# EAGLE design R7FS5D37A3A01CFM (EAGLE 9.6.2)
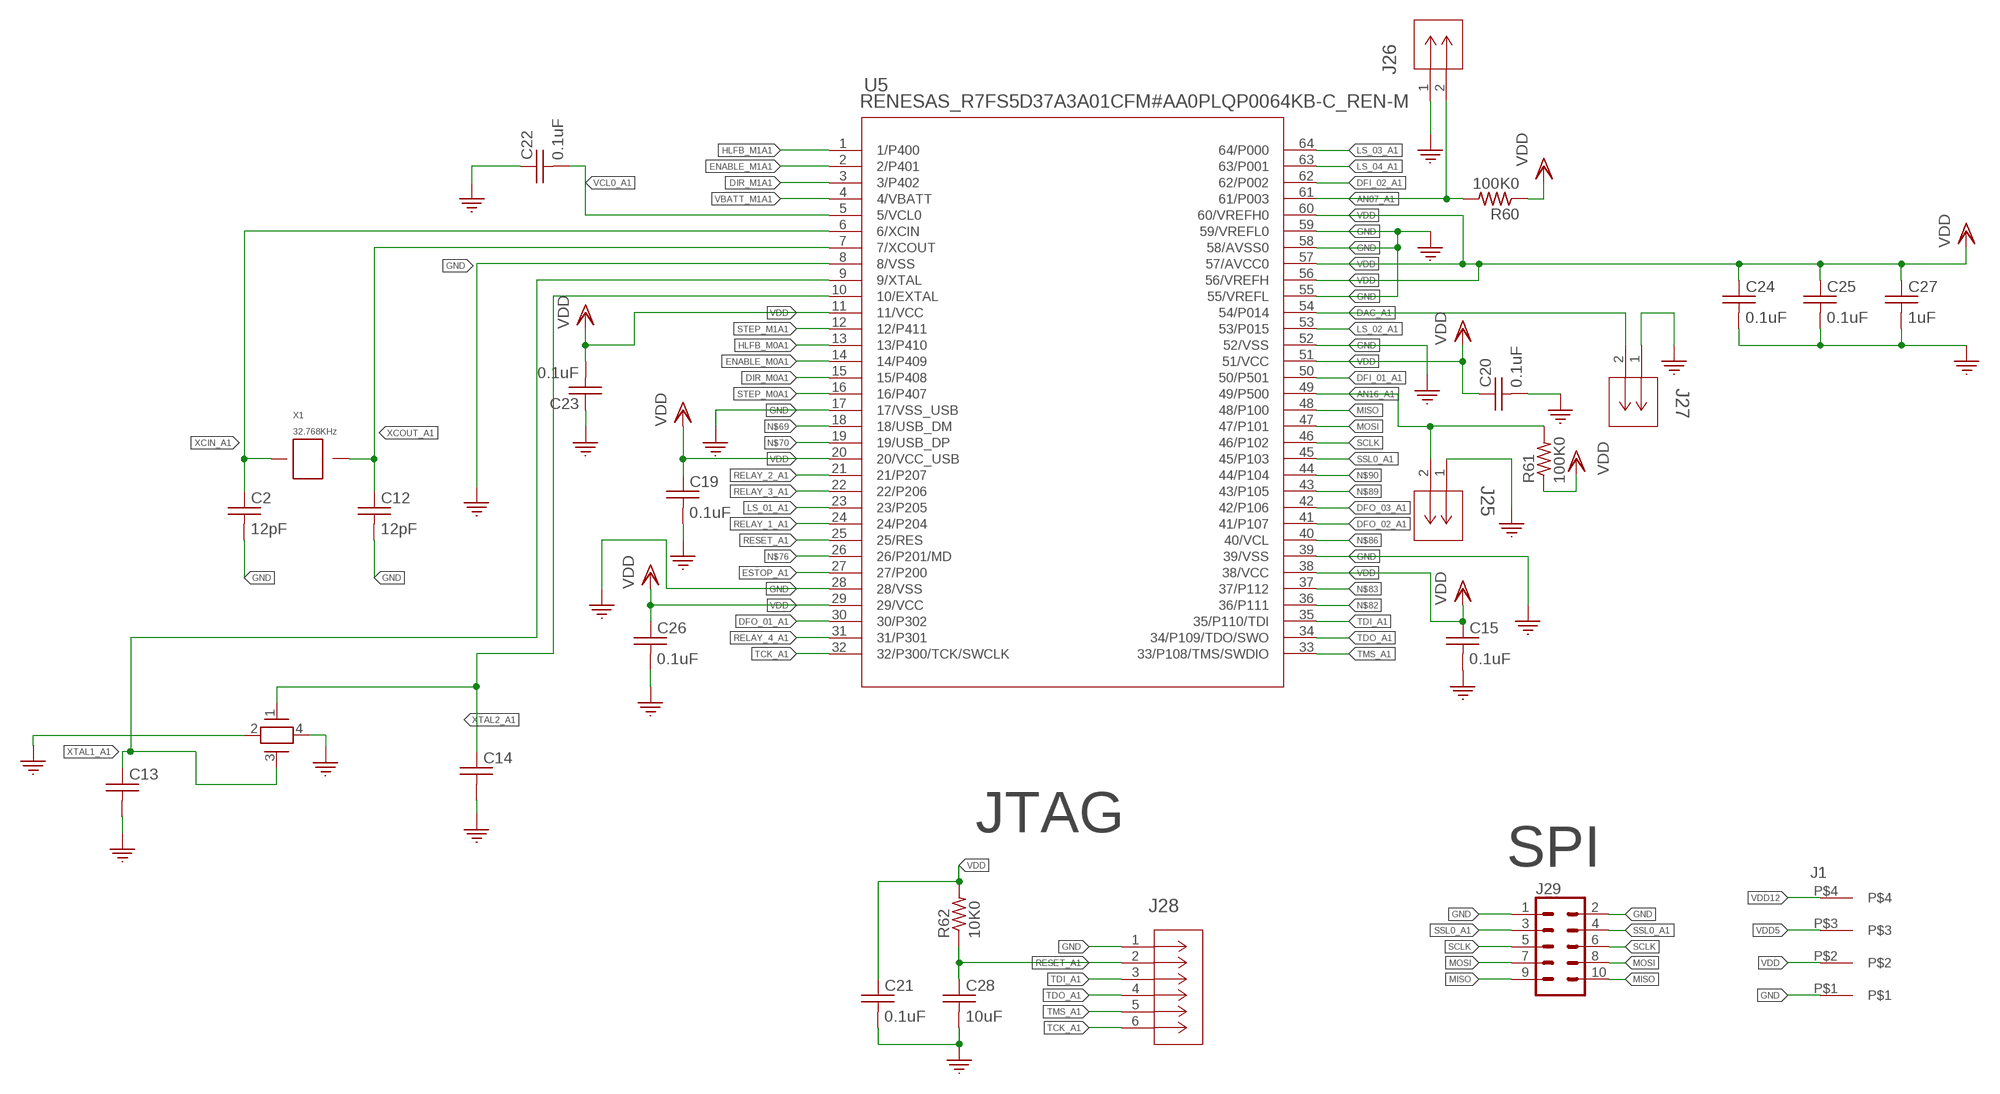
[diagram p0: schematic, sheet 1, part 1 of 3]
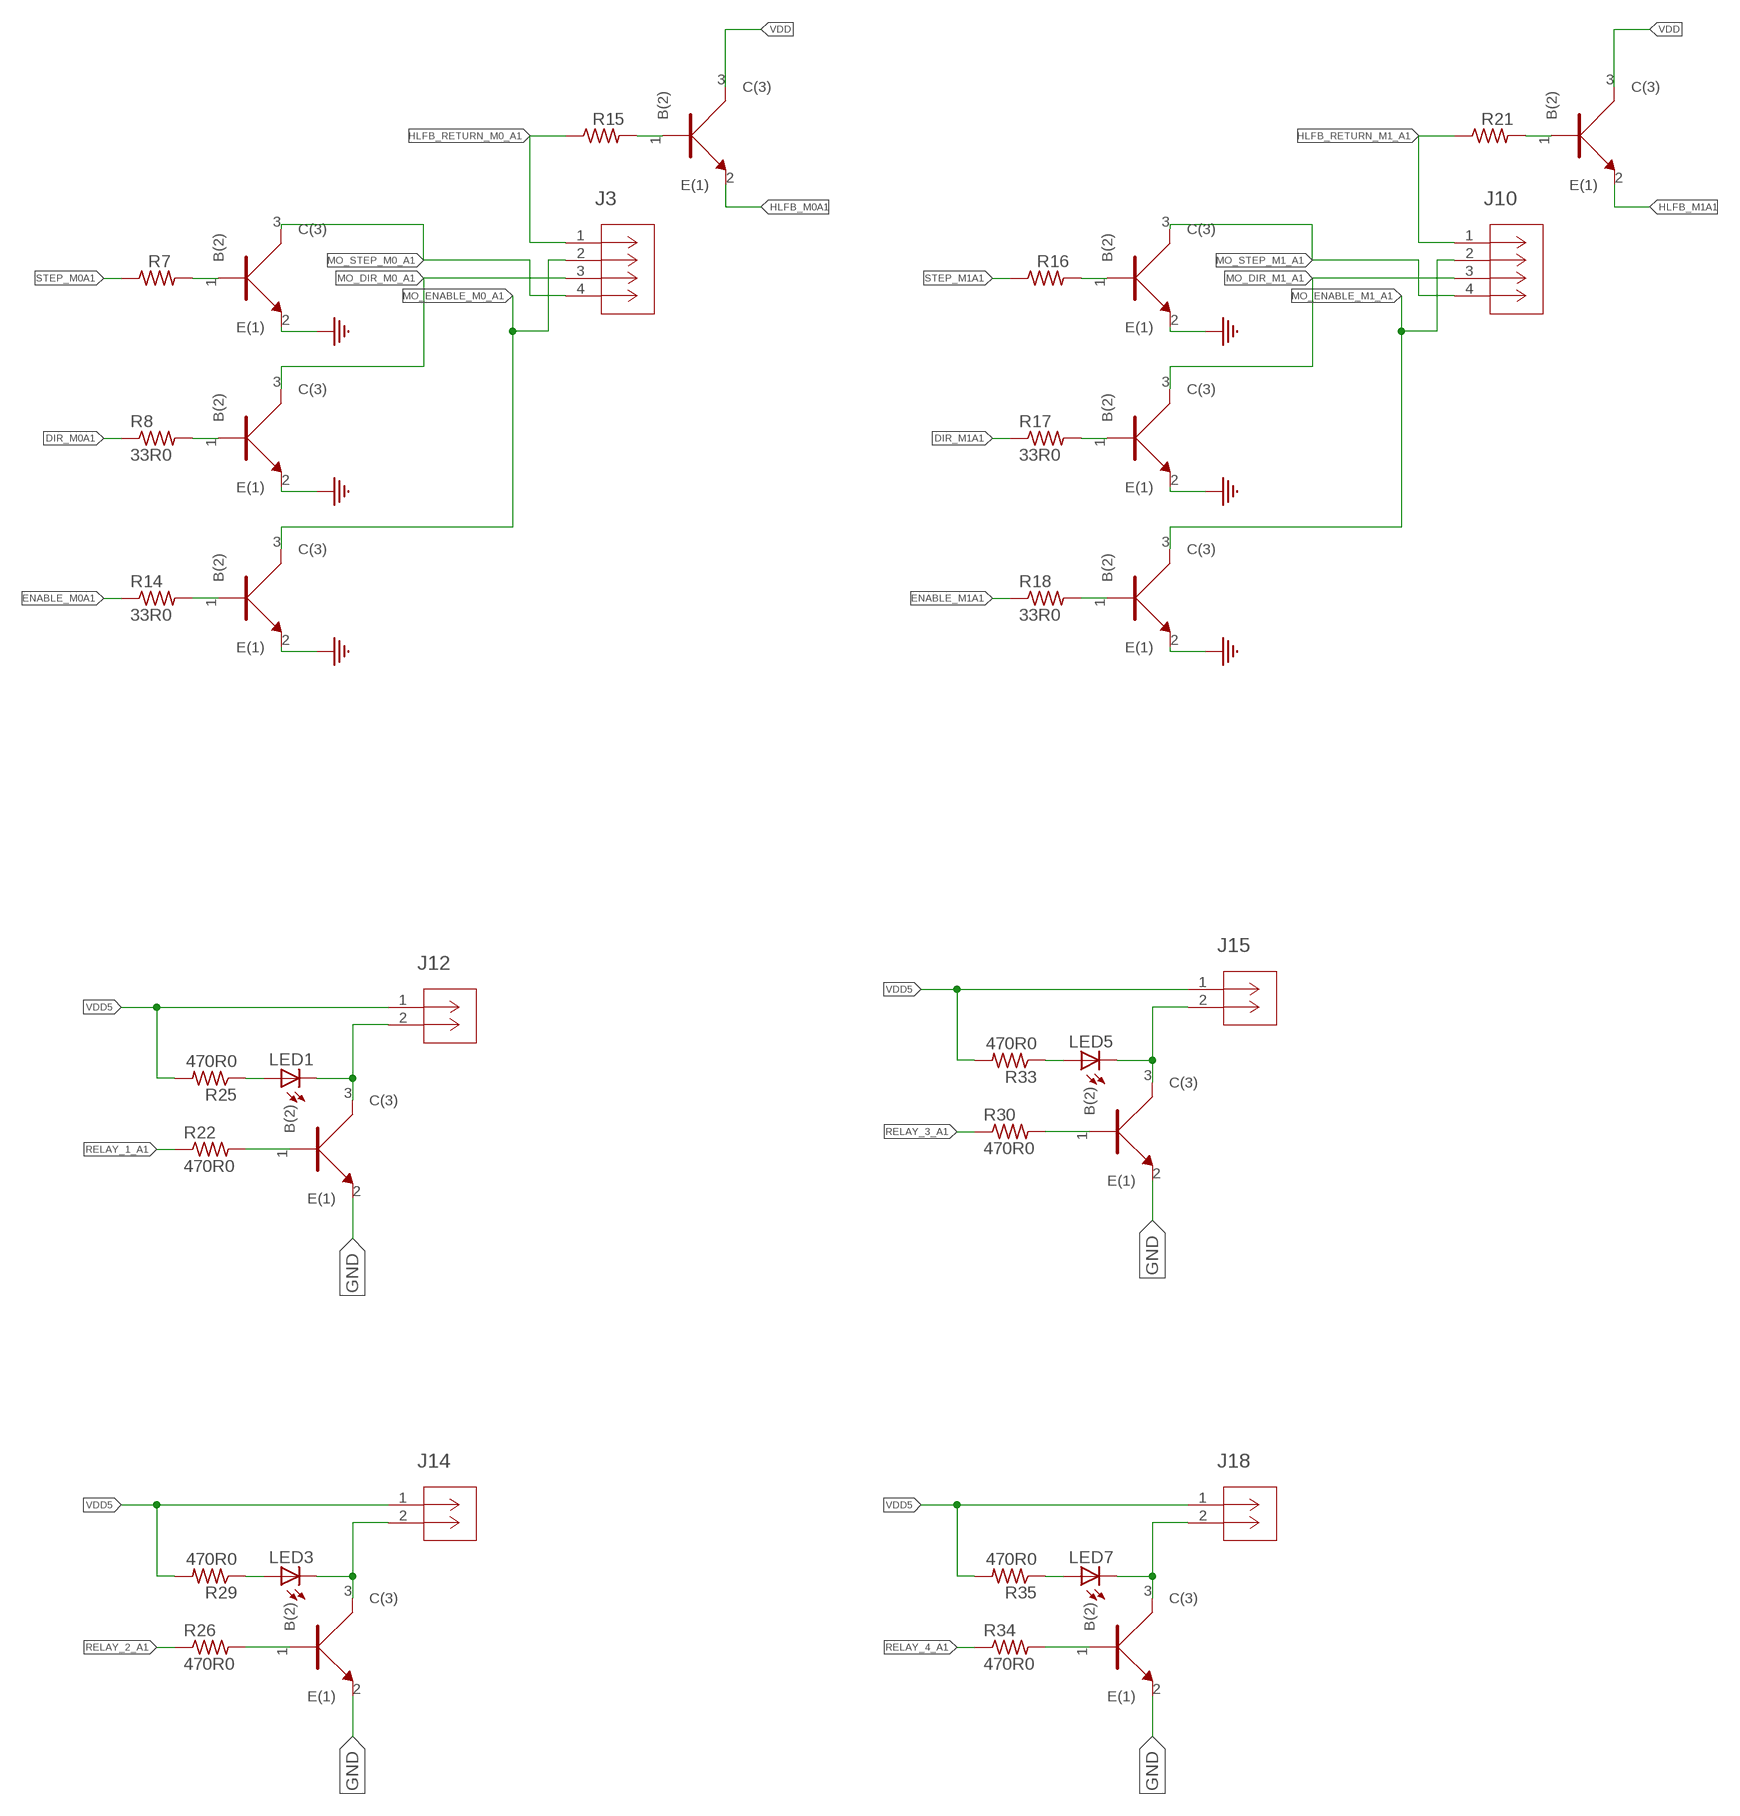
[diagram p1: schematic, sheet 1, part 2 of 3]
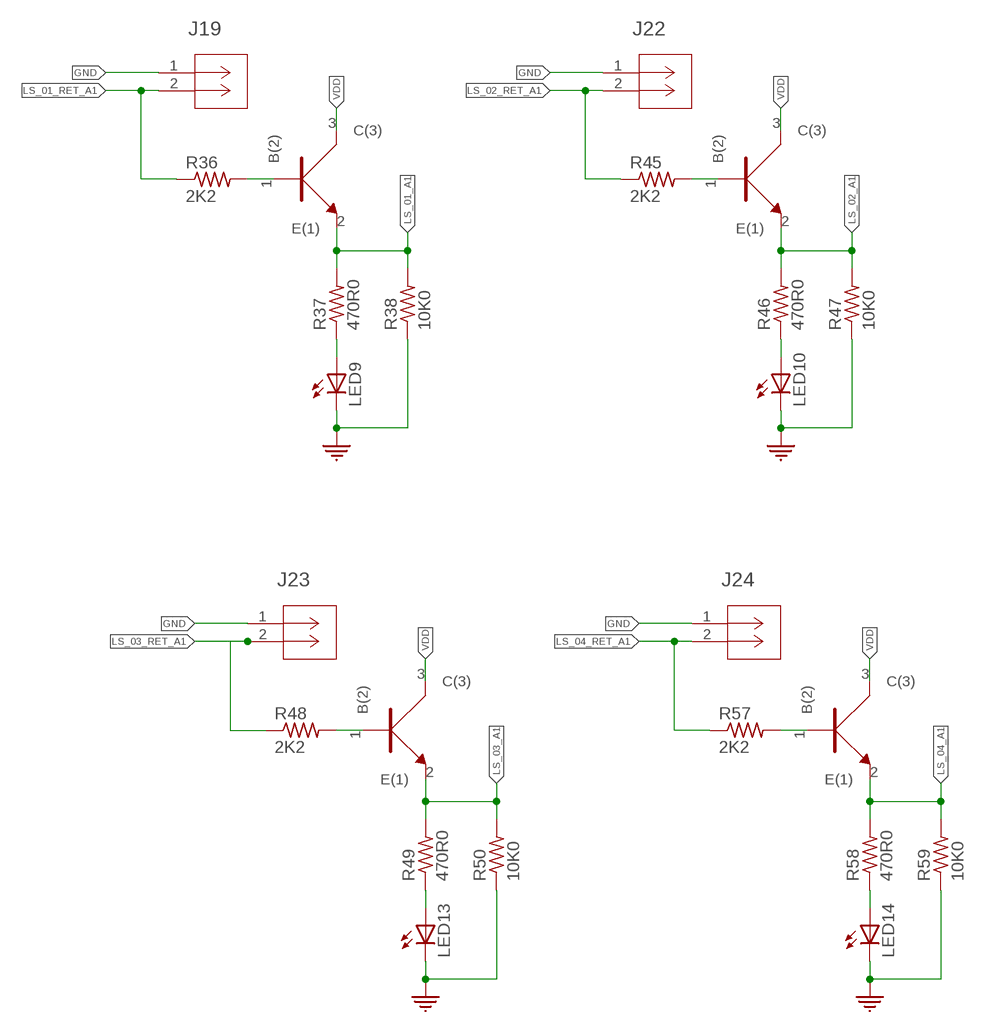
[diagram p2: schematic, sheet 1, part 3 of 3]

## Parts
C2  12pF  C_0402_12PF  [0402]
C12  12pF  C_0402_12PF  [0402]
C13  10pF  C_0402_10PF  [0402]
C14  10pF  C_0402_10PF  [0402]
C15  0.1uF  C_0402_0.1UF  [0402]
C19  0.1uF  C_0402_0.1UF  [0402]
C20  0.1uF  C_0402_0.1UF  [0402]
C21  0.1uF  C_0402_0.1UF  [0402]
C22  0.1uF  C_0402_0.1UF  [0402]
C23  0.1uF  C_0402_0.1UF  [0402]
C24  0.1uF  C_0402_0.1UF  [0402]
C25  0.1uF  C_0402_0.1UF  [0402]
C26  0.1uF  C_0402_0.1UF  [0402]
C27  1uF  C_0402_1UF  [0402]
C28  10uF  C_0402_10UF  [0402]
J1  4-pos  3.81MM_1_X_4_RT_ANGLE_PLUG_HEADER  [1X4_3.81MM_PITCH]
J3  CONN_530470410_PICOBLADE_X_4  [CON_530470410_MOL]
J10  CONN_530470410_PICOBLADE_X_4  [CON_530470410_MOL]
J12  CONN_530470210_PICOBLADE_X_2  [CON_530470210_MOL]
J14  CONN_530470210_PICOBLADE_X_2  [CON_530470210_MOL]
J15  CONN_530470210_PICOBLADE_X_2  [CON_530470210_MOL]
J18  CONN_530470210_PICOBLADE_X_2  [CON_530470210_MOL]
J19  CONN_530470210_PICOBLADE_X_2  [CON_530470210_MOL]
J22  CONN_530470210_PICOBLADE_X_2  [CON_530470210_MOL]
J23  CONN_530470210_PICOBLADE_X_2  [CON_530470210_MOL]
J24  CONN_530470210_PICOBLADE_X_2  [CON_530470210_MOL]
J25  CONN_530470210_PICOBLADE_X_2  [CON_530470210_MOL]
J26  CONN_530470210_PICOBLADE_X_2  [CON_530470210_MOL]
J27  CONN_530470210_PICOBLADE_X_2  [CON_530470210_MOL]
J28  CONN_530470610_PICOBLADE_X_6  [CON_530470610_MOL]
J29  CONN_05X2PTH  [2X5]
LED1  Green  LED_0805_GREEN  [0805]
LED3  Green  LED_0805_GREEN  [0805]
LED5  Green  LED_0805_GREEN  [0805]
LED7  Green  LED_0805_GREEN  [0805]
LED9  Green  LED_0805_GREEN  [0805]
LED10  Green  LED_0805_GREEN  [0805]
LED13  Green  LED_0805_GREEN  [0805]
LED14  Green  LED_0805_GREEN  [0805]
R7  33R0  R_0402_33R0  [0402]
R8  33R0  R_0402_33R0  [0402]
R14  33R0  R_0402_33R0  [0402]
R15  33R0  R_0402_33R0  [0402]
R16  33R0  R_0402_33R0  [0402]
R17  33R0  R_0402_33R0  [0402]
R18  33R0  R_0402_33R0  [0402]
R21  33R0  R_0402_33R0  [0402]
R22  470R0  R_0402_470R0  [0402]
R25  470R0  R_0402_470R0  [0402]
R26  470R0  R_0402_470R0  [0402]
R29  470R0  R_0402_470R0  [0402]
R30  470R0  R_0402_470R0  [0402]
R33  470R0  R_0402_470R0  [0402]
R34  470R0  R_0402_470R0  [0402]
R35  470R0  R_0402_470R0  [0402]
R36  2K2  R_0402_2K2  [0402]
R37  470R0  R_0402_470R0  [0402]
R38  10K0  R_0402_10K0  [0402]
R45  2K2  R_0402_2K2  [0402]
R46  470R0  R_0402_470R0  [0402]
R47  10K0  R_0402_10K0  [0402]
R48  2K2  R_0402_2K2  [0402]
R49  470R0  R_0402_470R0  [0402]
R50  10K0  R_0402_10K0  [0402]
R57  2K2  R_0402_2K2  [0402]
R58  470R0  R_0402_470R0  [0402]
R59  10K0  R_0402_10K0  [0402]
R60  100K0  R_0402_100K0  [0402]
R61  100K0  R_0402_100K0  [0402]
R62  10K0  R_0402_10K0  [0402]
U5  RENESAS_R7FS5D37A3A01CFM#AA0PLQP0064KB-C_REN-M  [PLQP0064KB-C_REN-M]
U6  NPN  BC846BW  [SOT323]
U7  NPN  BC846BW  [SOT323]
U8  NPN  BC846BW  [SOT323]
U13  NPN  BC846BW  [SOT323]
U14  NPN  BC846BW  [SOT323]
U15  NPN  BC846BW  [SOT323]
U16  NPN  BC846BW  [SOT323]
U18  NPN  BC846BW  [SOT323]
U20  NPN  BC846BW  [SOT323]
U22  NPN  BC846BW  [SOT323]
U24  NPN  BC846BW  [SOT323]
U26  NPN  BC846BW  [SOT323]
U27  NPN  BC846BW  [SOT323]
U30  NPN  BC846BW  [SOT323]
U31  NPN  BC846BW  [SOT323]
U34  NPN  BC846BW  [SOT323]
X1  32.768KHz  XTAL_32.768KHZ  [SMD_X_2_PADS]
Y2  XTAL_12MHZ_ABM8G-12.000MHZ-B4Y-T  [CRYSTAL_ABM8G_ABR]

## Nets
AN07_A1: J26.2 R60.P$2 U5.61(61/P003)
AN16_A1: J25.2 R61.P$2 U5.49(49/P500)
DAC_A1: J27.2 U5.54(54/P014)
DFI_01_A1: U5.50(50/P501)
DFI_02_A1: U5.62(62/P002)
DFO_01_A1: U5.30(30/P302)
DFO_02_A1: U5.41(41/P107)
DFO_03_A1: U5.42(42/P106)
DIR_M0A1: R8.P$1 U5.15(15/P408)
DIR_M1A1: R17.P$1 U5.3(3/P402)
ENABLE_M0A1: R14.P$1 U5.14(14/P409)
ENABLE_M1A1: R18.P$1 U5.2(2/P401)
ESTOP_A1: U5.27(27/P200)
GND: C2.P$2 C12.P$2 C13.P$2 C14.P$2 C15.P$2 C19.P$2 C20.P$2 C21.P$2 C22.P$1 C23.P$1 C24.P$2 C25.P$2 C26.P$2 C27.P$2 C28.P$2 J1.P$1 J19.1 J22.1 J23.1 J24.1 J25.1 J26.1 J27.1 J28.1 J29.1 J29.2 LED9.2(C) LED10.2(C) LED13.2(C) LED14.2(C) R38.P$1 R47.P$1 R50.P$1 R59.P$1 U5.8(8/VSS) U5.17(17/VSS_USB) U5.28(28/VSS) U5.39(39/VSS) U5.52(52/VSS) U5.55(55/VREFL) U5.58(58/AVSS0) U5.59(59/VREFL0) U6.2(E(1)) U7.2(E(1)) U8.2(E(1)) U14.2(E(1)) U15.2(E(1)) U16.2(E(1)) U20.2(E(1)) U22.2(E(1)) U24.2(E(1)) U26.2(E(1)) Y2.2 Y2.4
HLFB_M0A1: U5.13(13/P410) U13.2(E(1))
HLFB_M1A1: U5.1(1/P400) U18.2(E(1))
HLFB_RETURN_M0_A1: J3.1 R15.P$1
HLFB_RETURN_M1_A1: J10.1 R21.P$1
LS_01_A1: R37.P$2 R38.P$2 U5.23(23/P205) U27.2(E(1))
LS_01_RET_A1: J19.2 R36.P$1
LS_02_A1: R46.P$2 R47.P$2 U5.53(53/P015) U30.2(E(1))
LS_02_RET_A1: J22.2 R45.P$1
LS_03_A1: R49.P$2 R50.P$2 U5.64(64/P000) U31.2(E(1))
LS_03_RET_A1: J23.2 R48.P$1
LS_04_A1: R58.P$2 R59.P$2 U5.63(63/P001) U34.2(E(1))
LS_04_RET_A1: J24.2 R57.P$1
MISO: J29.9 J29.10 U5.48(48/P100)
MO_DIR_M0_A1: J3.3 U7.3(C(3))
MO_DIR_M1_A1: J10.3 U15.3(C(3))
MO_ENABLE_M0_A1: J3.2 U8.3(C(3))
MO_ENABLE_M1_A1: J10.2 U16.3(C(3))
MO_STEP_M0_A1: J3.4 U6.3(C(3))
MO_STEP_M1_A1: J10.4 U14.3(C(3))
MOSI: J29.7 J29.8 U5.47(47/P101)
N$6: R8.P$2 U7.1(B(2))
N$7: R14.P$2 U8.1(B(2))
N$14: R7.P$2 U6.1(B(2))
N$15: R15.P$2 U13.1(B(2))
N$16: R17.P$2 U15.1(B(2))
N$17: R18.P$2 U16.1(B(2))
N$18: R16.P$2 U14.1(B(2))
N$19: R21.P$2 U18.1(B(2))
N$23: R22.P$2 U20.1(B(2))
N$24: J12.2 LED1.2(C) U20.3(C(3))
N$25: LED1.1(A) R25.P$1
N$29: R26.P$2 U22.1(B(2))
N$30: J14.2 LED3.2(C) U22.3(C(3))
N$31: LED3.1(A) R29.P$1
N$35: R30.P$2 U24.1(B(2))
N$36: J15.2 LED5.2(C) U24.3(C(3))
N$37: LED5.1(A) R33.P$1
N$41: R34.P$2 U26.1(B(2))
N$42: J18.2 LED7.2(C) U26.3(C(3))
N$43: LED7.1(A) R35.P$1
N$44: R36.P$2 U27.1(B(2))
N$49: LED9.1(A) R37.P$1
N$50: R45.P$2 U30.1(B(2))
N$51: LED10.1(A) R46.P$1
N$52: R48.P$2 U31.1(B(2))
N$57: LED13.1(A) R49.P$1
N$58: R57.P$2 U34.1(B(2))
N$59: LED14.1(A) R58.P$1
N$69: U5.18(18/USB_DM)
N$70: U5.19(19/USB_DP)
N$76: U5.26(26/P201/MD)
N$82: U5.36(36/P111)
N$83: U5.37(37/P112)
N$86: U5.40(40/VCL)
N$89: U5.43(43/P105)
N$90: U5.44(44/P104)
RELAY_1_A1: R22.P$1 U5.24(24/P204)
RELAY_2_A1: R26.P$1 U5.21(21/P207)
RELAY_3_A1: R30.P$1 U5.22(22/P206)
RELAY_4_A1: R34.P$1 U5.31(31/P301)
RESET_A1: C28.P$1 J28.2 R62.P$1 U5.25(25/RES)
SCLK: J29.5 J29.6 U5.46(46/P102)
SSL0_A1: J29.3 J29.4 U5.45(45/P103)
STEP_M0A1: R7.P$1 U5.16(16/P407)
STEP_M1A1: R16.P$1 U5.12(12/P411)
TCK_A1: J28.6 U5.32(32/P300/TCK/SWCLK)
TDI_A1: J28.3 U5.35(35/P110/TDI)
TDO_A1: J28.4 U5.34(34/P109/TDO/SWO)
TMS_A1: J28.5 U5.33(33/P108/TMS/SWDIO)
VBATT_M1A1: U5.4(4/VBATT)
VCL0_A1: C22.P$2 U5.5(5/VCL0)
VDD: C15.P$1 C19.P$1 C20.P$1 C21.P$1 C23.P$2 C24.P$1 C25.P$1 C26.P$1 C27.P$1 J1.P$2 R60.P$1 R61.P$1 R62.P$2 U5.11(11/VCC) U5.20(20/VCC_USB) U5.29(29/VCC) U5.38(38/VCC) U5.51(51/VCC) U5.56(56/VREFH) U5.57(57/AVCC0) U5.60(60/VREFH0) U13.3(C(3)) U18.3(C(3)) U27.3(C(3)) U30.3(C(3)) U31.3(C(3)) U34.3(C(3))
VDD5: J1.P$3 J12.1 J14.1 J15.1 J18.1 R25.P$2 R29.P$2 R33.P$2 R35.P$2
VDD12: J1.P$4
XCIN_A1: C2.P$1 U5.6(6/XCIN) X1.P$1
XCOUT_A1: C12.P$1 U5.7(7/XCOUT) X1.P$2
XTAL1_A1: C13.P$1 U5.9(9/XTAL) Y2.3
XTAL2_A1: C14.P$1 U5.10(10/EXTAL) Y2.1

## Notes on the sheet
- JTAG
- SPI

## Library data of the parts
C2 C12 = 3D_MIG_Controller:C_0402_12PF; PARTNO: CL05C120JB5NNNC
C13 C14 = 3D_MIG_Controller:C_0402_10PF; PARTNO: CC0402JRNPO9BN100
C15 C19-C26 = 3D_MIG_Controller:C_0402_0.1UF; PARTNO: CL05F104ZO5NNNC
C27 = 3D_MIG_Controller:C_0402_1UF; PARTNO: CL05A105KO5NNNC
C28 = 3D_MIG_Controller:C_0402_10UF; PARTNO: CL05A106MP8NUB8
J1 = 3D_MIG_Controller:3.81MM_1_X_4_RT_ANGLE_PLUG_HEADER: 4 Position Terminal Block Header, Male Pins, Shrouded (4 Side) 0.150" (3.81mm) 90°, Right Angle - Through Hole; PARTNO: 691322310004
J3 J10 = 3D_MIG_Controller:CONN_530470410_PICOBLADE_X_4; COPYRIGHT: Copyright (C) 2022 Ultra Librarian. All rights reserved.; MFR_NAME: Molex Connector Corporation; PARTNO: 530470410
J12 J14 J15 J18 J19 J22-J27 = 3D_MIG_Controller:CONN_530470210_PICOBLADE_X_2; MFR_NAME: Molex Connector Corporation; PARTNO: 530470210
J28 = 3D_MIG_Controller:CONN_530470610_PICOBLADE_X_6; COPYRIGHT: Copyright (C) 2023 Ultra Librarian. All rights reserved.; MFR_NAME: Molex Connector Corporation; PARTNO: 530470610
J29 = 3D_MIG_Controller:CONN_05X2: Multi connection point. Often used as Generic Header-pin footprint for 0.1 inch spaced/style header connections For AVR SPI programming port, see special device with nice symbol: "AVR_SPI_PROG_5x2.dev" You can populate with any combo of single row headers, but if you'd like an exact match, check these: 2x5 AVR ICSP Male Header <https://www.sparkfun.com/products/778> (PRT-00778) 2x5 Pin Shrouded Header <https://www.sparkfun.com/products/8506> (PRT-08506) On any of the 0.1 inch spaced packages, you can populate with these: Break Away Headers - Straight <https://www.sparkfun.com/products/116> (PRT-00116) Break Away Male Headers - Right Angle <https://www.sparkfun.com/products/553> (PRT-00553) Female Headers <https://www.sparkfun.com/products/115> (PRT-00115) Break Away Headers - Machine Pin <https://www.sparkfun.com/products/117> (PRT-00117) Break Away Female Headers - Swiss Machine Pin <https://www.sparkfun.com/products/743> (PRT-00743) Special note: the shrouded connector mates well with our 5x2 ribbon cables: 2x5 Pin IDC Ribbon Cable <https://www.sparkfun.com/products/8535> (PRT-08535); PROD_ID: CONN-08499; SF_ID: PRT-0778
LED1 LED3 LED5 LED7 LED9 LED10 LED13 LED14 = 3D_MIG_Controller:LED_0805_GREEN: Green 570nm LED Indication - Discrete 2.2V 0805 (2012 Metric); PARTNO: LG R971-KN-1
R7 R8 R14-R18 R21 = 3D_MIG_Controller:R_0402_33R0; PARTNO: RMCF0402JT33R0
R22 R25 R26 R29 R30 R33-R35 R37 R46 R49 R58 = 3D_MIG_Controller:R_0402_470R0; PARTNO: RMCF0402JT470R
R36 R45 R48 R57 = 3D_MIG_Controller:R_0402_2K2; PARTNO: RMCF0402JT2K20
R38 R47 R50 R59 R62 = 3D_MIG_Controller:R_0402_10K0; PARTNO: RMCF0402JT10K0
R60 R61 = 3D_MIG_Controller:R_0402_100K0; PARTNO: RCG0402100KFKED
U5 = 3D_MIG_Controller:RENESAS_R7FS5D37A3A01CFM#AA0; COPYRIGHT: Copyright (C) 2023 Ultra Librarian. All rights reserved.; MFR_NAME: Renesas Electronics; PARTNO: R7FS3A37A3A01CFM#AA0
U6-U8 U13-U16 U18 U20 U22 U24 U26 U27 U30 U31 U34 = 3D_MIG_Controller:BC846BW: Bipolar (BJT) Transistor NPN 100MHz Surface Mount SOT-323; PARTNO: BC846BW_NPN
X1 = 3D_MIG_Controller:XTAL_32.768KHZ; PARTNO: ABS07-32.768KHZ-T
Y2 = 3D_MIG_Controller:XTAL_12MHZ_ABM8G-12.000MHZ-B4Y-T; COPYRIGHT: Copyright (C) 2023 Ultra Librarian. All rights reserved.; MFR_NAME: Abracon; PARTNO: ABM8G-12.000MHZ-B4Y-T

## Board
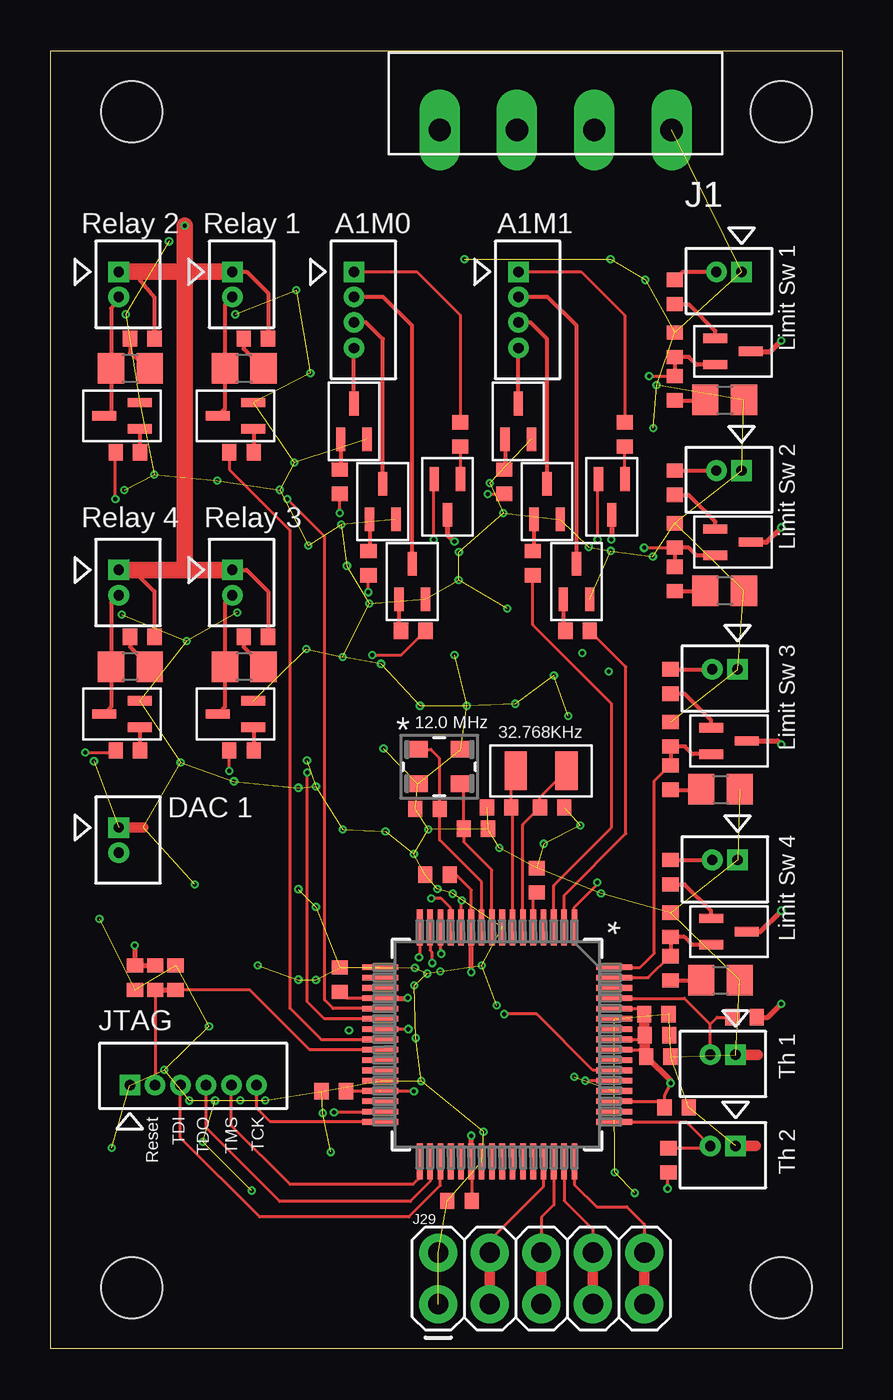
[diagram p3: board, top side]
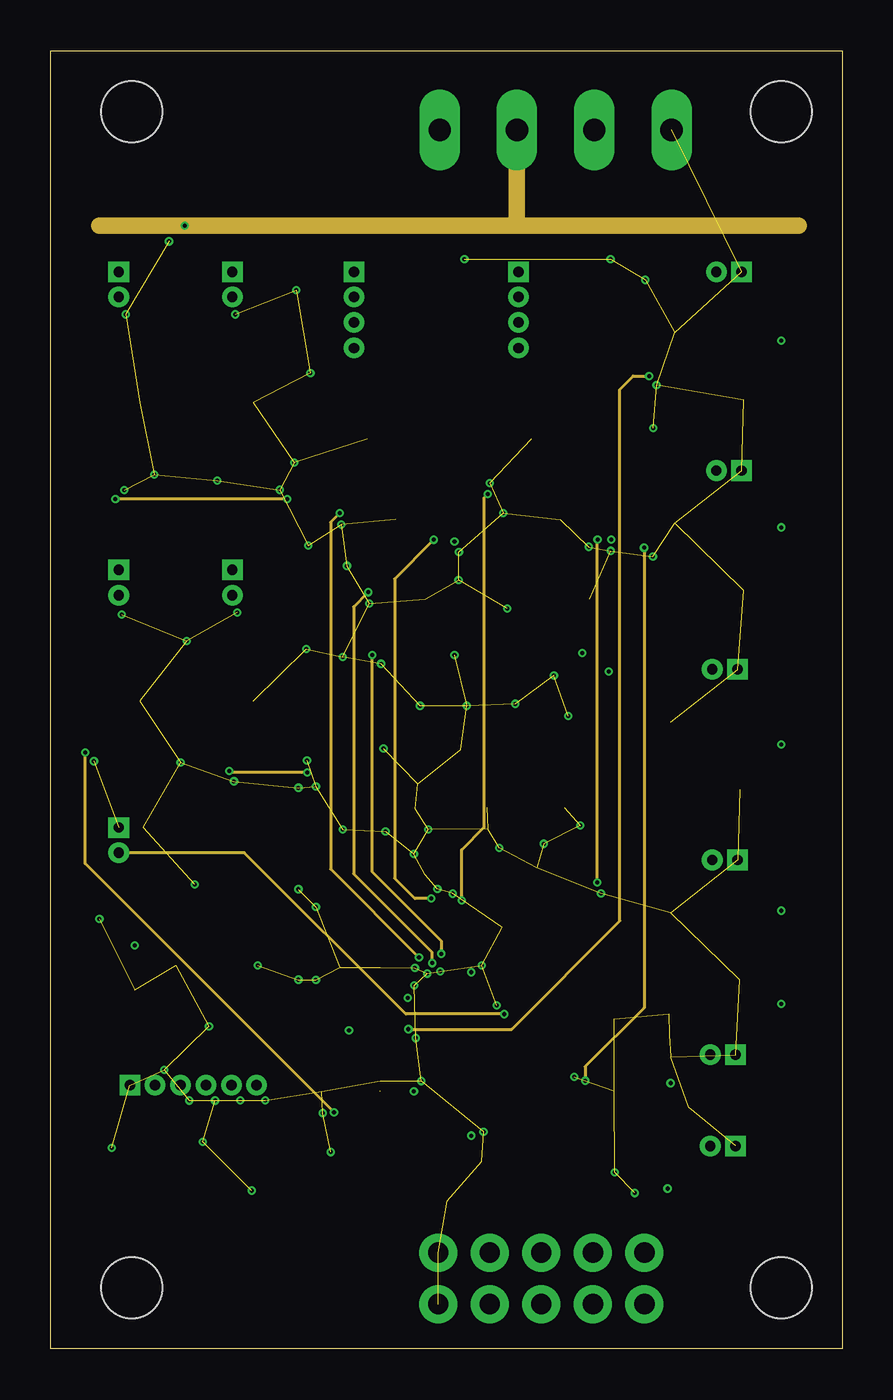
[diagram p4: board, inner layer Route3]
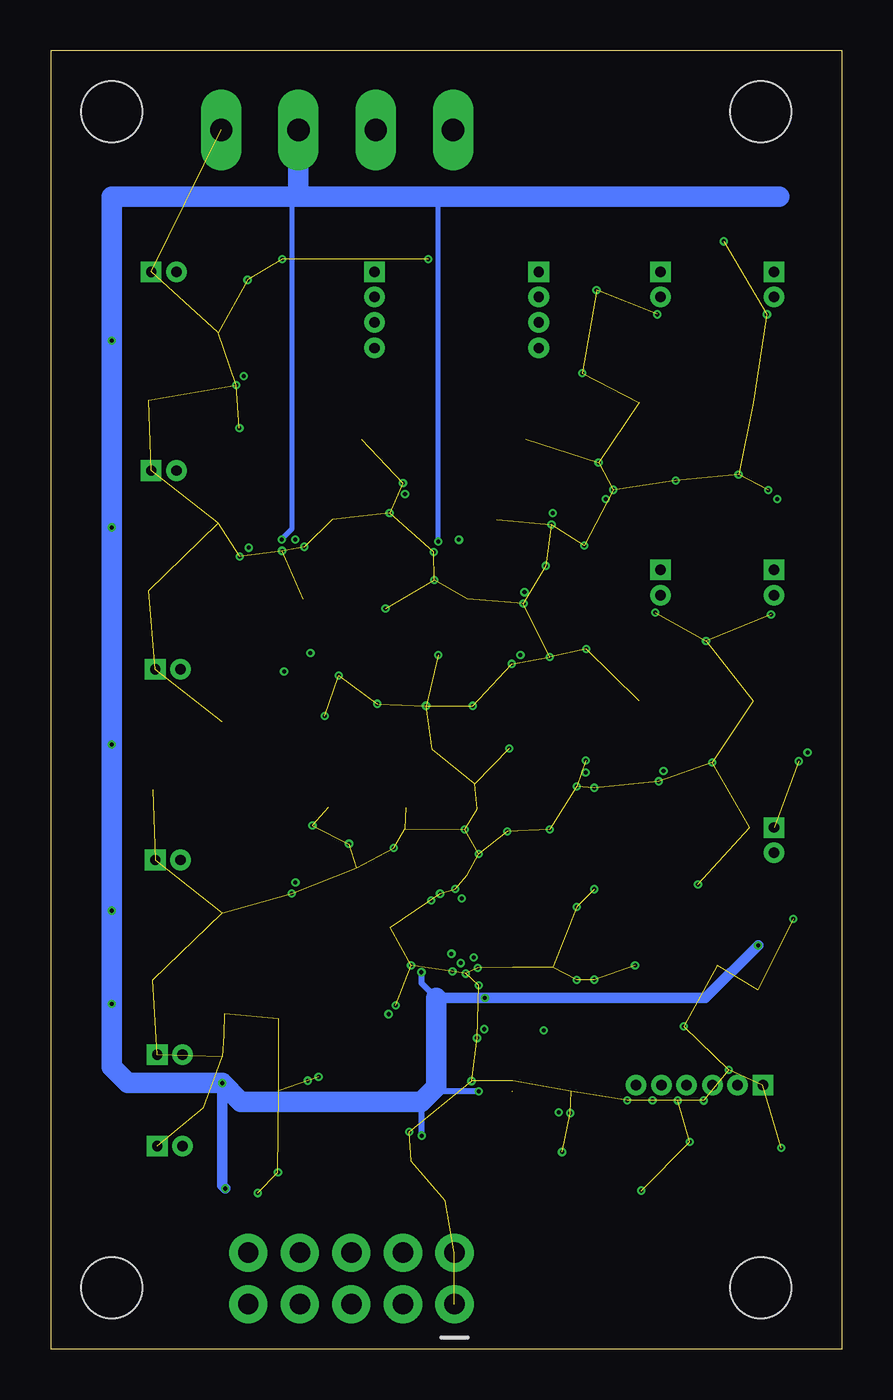
[diagram p5: board, bottom side, seen from below]

Size 39 x 64 mm. Coordinates in mm from the lower left corner, seen from the top.
Outline: 0,64 39,64 39,0 0,0 0,64
Copper layers ([3:[2:[15:1+2*3+14*15+16:2]:15]]): Top 0.0348mm / dielectric 0.1mm / Route2 0.0348mm / dielectric 0.546mm / Route3 0.0348mm / dielectric 0.1mm / Route14 0.0348mm / dielectric 0.546mm / Route15 0.0348mm / dielectric 0.1mm / Bottom 0.0348mm
Design rules "default *": minimum track width 0.15mm, minimum drill 0.2mm, track to track 6mil, track to pad 6mil, pad to pad 6mil, via to via 6mil, smd to smd 6mil, copper to edge 40mil, drill to drill 6mil, minimum pad ring 10mil, minimum via ring 4mil, stop-mask expansion 4mil, vias tented up to drill 0mil, thermal gap 10mil
Holes 3 mm at 36,3 36,61 4,61 4,3

### Footprints (pad centres in the part's own frame; a part is rotated, then mirrored left to right if it is on the bottom)
0402 = smd 0.8 x 0.7: P$1 0,0.6; P$2 0,-0.6
1X4_3.81MM_PITCH = drill 1.1 pad 2 long: P$1 0,0; P$2 3.81,0; P$3 7.62,0; P$4 11.43,0
CON_530470410_MOL = drill 0.508 pad 0.838 square: 1 0,0 | drill 0.508 pad 0.838: 2 -1.245,0; 3 -2.489,0; 4 -3.759,0
CON_530470210_MOL = drill 0.508 pad 0.838 square: 1 0,0 | drill 0.508 pad 0.838: 2 -1.245,0
CON_530470610_MOL = drill 0.508 pad 0.838 square: 1 0,0 | drill 0.508 pad 0.838: 2 -1.245,0; 3 -2.489,0; 4 -3.759,0; 5 -5.004,0; 6 -6.248,0
2X5 = drill 1 pad 1.88: 1 0,0; 2 0,2.54; 3 2.54,0; 4 2.54,2.54; 5 5.08,0; 6 5.08,2.54; 7 7.62,0; 8 7.62,2.54; 9 10.16,0; 10 10.16,2.54
0805 = smd 1.3 x 1.5: 1 -0.95,0; 2 0.95,0
PLQP0064KB-C_REN-M = smd 1.778 x 0.279: 1 -5.766,3.81; 2 -5.766,3.302; 3 -5.766,2.794; 4 -5.766,2.286; 5 -5.766,1.778; 6 -5.766,1.27; 7 -5.766,0.762; 8 -5.766,0.254; 9 -5.766,-0.254; 10 -5.766,-0.762; 11 -5.766,-1.27; 12 -5.766,-1.778; 13 -5.766,-2.286; 14 -5.766,-2.794; 15 -5.766,-3.302; 16 -5.766,-3.81; 33 5.766,-3.81; 34 5.766,-3.302; 35 5.766,-2.794; 36 5.766,-2.286; 37 5.766,-1.778; 38 5.766,-1.27; 39 5.766,-0.762; 40 5.766,-0.254; 41 5.766,0.254; 42 5.766,0.762; 43 5.766,1.27; 44 5.766,1.778; 45 5.766,2.286; 46 5.766,2.794; 47 5.766,3.302; 48 5.766,3.81 | smd 0.279 x 1.778: 17 -3.81,-5.766; 18 -3.302,-5.766; 19 -2.794,-5.766; 20 -2.286,-5.766; 21 -1.778,-5.766; 22 -1.27,-5.766; 23 -0.762,-5.766; 24 -0.254,-5.766; 25 0.254,-5.766; 26 0.762,-5.766; 27 1.27,-5.766; 28 1.778,-5.766; 29 2.286,-5.766; 30 2.794,-5.766; 31 3.302,-5.766; 32 3.81,-5.766; 49 3.81,5.766; 50 3.302,5.766; 51 2.794,5.766; 52 2.286,5.766; 53 1.778,5.766; 54 1.27,5.766; 55 0.762,5.766; 56 0.254,5.766; 57 -0.254,5.766; 58 -0.762,5.766; 59 -1.27,5.766; 60 -1.778,5.766; 61 -2.286,5.766; 62 -2.794,5.766; 63 -3.302,5.766; 64 -3.81,5.766
SOT323 = smd 0.457 x 1.168: 1 -0.65,-0.876; 2 0.65,-0.876; 3 0,0.876
SMD_X_2_PADS = smd 1.9 x 1.1: P$1 0,1.25; P$2 0,-1.25
CRYSTAL_ABM8G_ABR = smd 0.991 x 0.813: 1 -1.054,0.85; 2 -1.054,-0.85; 3 1.054,-0.85; 4 1.054,0.85

### Placement (x,y rotation side)
C2  24.71,26.69 90 top
C12  22.1,26.69 270 top
C13  20.95,25.64 90 top
C14  18.57,26.61 270 top
C15  20.15,7.3 270 top
C19  14.25,18.2 180 top
C20  30.85,11.9 90 top
C21  4.15,18.3 0 top
C22  23.95,23.1 0 top
C23  19.06,23.37 90 top
C24  29.95,14.4 90 top
C25  29.88,15.47 90 top
C26  13.95,12.7 270 top
C27  29.85,16.5 90 top
C28  6.15,18.3 180 top
J1  30.6,60.1 180 top
J3  14.95,53.1 90 top
J10  23.05,53.1 90 top
J12  8.95,53.1 90 top
J14  3.35,53.1 90 top
J15  8.95,38.4 90 top
J18  3.35,38.4 90 top
J19  34.05,53.1 0 top
J22  34.05,43.3 0 top
J23  33.85,33.5 0 top
J24  33.85,24.1 0 top
J25  33.75,10 0 top
J26  33.75,14.5 0 top
J27  3.35,25.7 90 top
J28  3.9,13 180 top
J29  19.1,2.2 0 top
LED1  9.53,48.33 180 top
LED3  3.93,48.33 180 top
LED5  9.53,33.63 180 top
LED7  3.93,33.63 180 top
LED9  33.21,46.78 0 top
LED10  33.21,37.38 0 top
LED13  33.01,27.58 0 top
LED14  33.01,18.18 0 top
R7  14.25,42.75 180 top
R8  15.66,38.73 180 top
R14  17.87,35.4 270 top
R15  20.19,45.08 0 top
R16  22.35,42.75 180 top
R17  23.76,38.73 180 top
R18  25.97,35.4 270 top
R21  28.29,45.08 0 top
R22  9.4,44.2 90 top
R25  10.11,49.8 90 top
R26  3.8,44.2 90 top
R29  4.51,49.8 90 top
R30  9.4,29.5 90 top
R33  10.11,35.11 90 top
R34  3.8,29.5 90 top
R35  4.51,35.11 90 top
R36  30.75,52.1 0 top
R37  30.75,47.36 180 top
R38  30.75,49.5 0 top
R45  30.75,42.7 0 top
R46  30.75,37.96 180 top
R47  30.75,40.1 0 top
R48  30.55,32.9 0 top
R49  30.55,28.16 180 top
R50  30.55,30.3 0 top
R57  30.55,23.5 0 top
R58  30.55,18.76 180 top
R59  30.55,20.9 0 top
R60  34.2,16.35 270 top
R61  30.45,9.3 180 top
R62  5.15,18.3 180 top
U5  22,15 270 top
U6  14.94,45.72 0 top
U7  16.36,41.77 0 top
U8  17.81,37.83 0 top
U13  19.55,42 180 top
U14  23.04,45.72 0 top
U15  24.46,41.77 0 top
U16  25.91,37.83 0 top
U18  27.65,42 180 top
U20  9.11,46 90 top
U22  3.51,46 90 top
U24  9.11,31.3 90 top
U26  3.51,31.3 90 top
U27  33.63,49.17 270 top
U30  33.63,39.77 270 top
U31  33.43,29.97 270 top
U34  33.43,20.57 270 top
X1  24.17,28.49 270 top
Y2  19.15,28.7 0 top

### Tracks (layer width: path | path; a pad name or v marks a point on that pad's centre or on a via)
AN07_A1
  Top 0.15: J26.2 32.51,16 | R60.P$2 32.85,16.35 32.51,16 | 32.51,16 31.23,17.29 U5.61
AN16_A1
  Top 0.15: U5.49 31.31,11.19 J25.2 32.41,9.9 R61.P$2
DAC_A1  (via drill 0.2)
  Top 0.15: U5.54 26.72,13.73 23.95,16.5 v22.35,16.5
  Route3 0.15: J27.2 9.54,24.45 17.5,16.5 v22.35,16.5
DIR_M0A1  (via drill 0.2)
  Top 0.15: v18.8,19.02 18.8,19.55 18.7,19.64 U5.15
  Top 0.152: v15.65,37.3 R8.P$1
  Route3 0.15: v15.65,37.3 14.93,36.58 14.93,23.41 18.8,19.55 v18.8,19.02
DIR_M1A1
  Top 0.15: U5.3 24.79,22.84 27.65,25.7 27.65,31.8 23.76,35.69 R17.P$1
ENABLE_M0A1  (via drill 0.2)
  Top 0.15: v15.85,34.2 17.27,34.2 R14.P$1 | U5.14 19.21,19.52 v19.25,19.48
  Route3 0.15: v19.25,19.48 19.25,20.1 15.85,23.5 v15.85,34.2
ENABLE_M1A1
  Top 0.15: U5.2 25.3,22.35 28.35,25.4 28.35,33.62 R18.P$1
GND  (via drill 0.2)  (139 unrouted)
  Top 0.508: J26.1 34.85,14.5 | J25.1 34.75,10 | J27.1 4.55,25.7
  other vias: 5.83,54.6 3.63,42.33 11.28,42.35 14.32,40.64 20.39,53.73 27.59,53.73 16.28,33.77 15.7,36.74 29.68,39.06 27.6,39.34 26.51,39.54 29.86,47.51 19.81,22.44 19.06,22.67 27.12,22.45 25.8,13.41 17.99,15.32 19.2,18.6 18.55,18.5 17.95,18.78 21.99,16.93 13.4,11.62 28.79,7.68 2.13,28.97 9.03,27.98 12.63,29.01 21.24,18.91 17.91,17.92 21.33,10.69 18.26,13.2 3.5,36.2 9.2,36.3 3.7,51 9.1,51 7.1,22.9 10.2,18.9 12.21,18.2 13.07,18.19 13.07,21.79 12.21,22.66 12.21,27.66 13.07,27.73 14.4,25.6 16.5,25.5 17.9,24.4 18.6,25.6 22.1,24.7 24.3,24.9 26.1,25.8 6.4,28.9 6.7,34.9 12.6,34.5 14.4,34.1 16.4,29.6 18.2,31.7 20.5,31.7 19.9,34.2 20.1,37.9 22.5,36.5 22.9,31.8 24.8,33.2 25.5,31.2 5.1,43.1 8.2,42.8 12,43.7 12.7,39.6 14.6,38.6 20.12,39.28 22.3,41.2 21.64,42.69 12.1,52.2 12.8,48.1 29.3,52.7 29.7,45.4 27.8,8.7 13.8,9.7 3,9.9 7.8,15.9 2.4,21.2 9.9,7.8 8.1,12.24 6.82,12.24 9.34,12.25 10.58,12.25 5.59,13.75 7.5,10.2
HLFB_M0A1  (via drill 0.2)
  Top 0.15: v18.88,39.89 18.88,42.86 U13.2 | U5.13 19.71,21.74 19.25,22.2 v18.75,22.2
  Route3 0.15: v18.75,22.2 17.95,22.2 16.95,23.2 16.95,37.96 v18.88,39.89
HLFB_M1A1  (via drill 0.2)
  Top 0.15: U5.1 25.81,21.77 26.94,22.9 v26.94,22.99 | v26.95,39.9 26.95,42.83 U18.2
  Route3 0.15: v26.94,22.99 v26.94,39.89 v26.95,39.9
HLFB_RETURN_M0_A1
  Top 0.152: J3.1 18.04,53.11 20.19,50.96 R15.P$1
HLFB_RETURN_M1_A1
  Top 0.152: J10.1 26.14,53.11 28.29,50.96 R21.P$1
LS_01_A1  (via drill 0.2)
  Top 0.15: v17.63,15.76 U5.23 | v29.49,47.96 R37.P$2
  Top 0.2: R37.P$2 R38.P$2 31.45,48.9 31.83,48.52 U27.2
  Route3 0.15: v17.63,15.76 22.71,15.76 28.05,21.1 28.05,47.3 28.71,47.96 v29.49,47.96
LS_01_RET_A1
  Top 0.2: R36.P$1 31.15,53.1 J19.2
LS_02_A1  (via drill 0.2)
  Top 0.15: U5.53 v26.34,13.22 | v29.24,39.5 R47.P$2
  Top 0.2: R46.P$2 R47.P$2 31.45,39.5 31.83,39.12 U30.2
  Route3 0.15: v29.24,39.5 29.24,39.08 29.24,39.07 29.24,16.82 26.34,13.92 v26.34,13.22
LS_02_RET_A1
  Top 0.2: R45.P$1 J22.2
LS_03_A1
  Top 0.152: U5.64 29.06,18.81 29.75,19.5 29.75,28 30.51,28.76 R49.P$2
  Top 0.2: R49.P$2 R50.P$2 31.25,29.7 31.63,29.32 U31.2
LS_03_RET_A1
  Top 0.2: R48.P$1 J23.2
LS_04_A1
  Top 0.152: U5.63 29.45,18.3 30.55,19.4
  Top 0.2: R58.P$2 30.55,19.4 R59.P$2 31.25,20.3 31.63,19.92 U34.2
LS_04_RET_A1
  Top 0.2: R57.P$1 J24.2
MISO
  Top 0.15: U5.48 25.81,8.09 26.9,7 28.4,7 29.26,6.14 J29.10
  Top 0.508: J29.10 J29.9
MO_DIR_M0_A1
  Top 0.2: U7.3 16.36,49.79 15.53,50.62 J3.3
MO_DIR_M1_A1
  Top 0.2: U15.3 24.46,49.79 23.63,50.62 J10.3
MO_ENABLE_M0_A1
  Top 0.2: 17.81,41.41 U8.3 17.81,50.44 16.39,51.86 J3.2
MO_ENABLE_M1_A1
  Top 0.2: 25.91,41.41 U16.3 25.91,50.44 24.49,51.86 J10.2
MO_STEP_M0_A1
  Top 0.2: U6.3 J3.4
MO_STEP_M1_A1
  Top 0.2: U14.3 J10.4
MOSI
  Top 0.15: U5.47 25.3,7.3 26.72,5.88 J29.8
  Top 0.508: J29.8 J29.7
N$6
  Top 0.2: U7.1 15.71,39.39 R8.P$2
N$7
  Top 0.2: U8.1 17.16,35.5 R14.P$2
N$14
  Top 0.2: U6.1 14.29,43.4 R7.P$2
N$15
  Top 0.152: U13.1 R15.P$2
N$16
  Top 0.2: U15.1 23.81,39.39 R17.P$2
N$17
  Top 0.2: U16.1 25.26,35.5 R18.P$2
N$18
  Top 0.2: U14.1 22.39,43.4 R16.P$2
N$19
  Top 0.152: U18.1 R21.P$2
N$23
  Top 0.2: U20.1 10,45.31 R22.P$2
N$24
  Top 0.2: J12.2 8.58,51.48 LED1.2 8.58,46.35 U20.3
N$25
  Top 0.2: R25.P$1 9.51,49.3 LED1.1
N$29
  Top 0.2: U22.1 4.4,45.11 R26.P$2
N$30
  Top 0.2: J14.2 2.98,51.28 LED3.2 2.98,46.15 U22.3
N$31
  Top 0.2: R29.P$1 3.91,49.1 LED3.1
N$35
  Top 0.2: U24.1 10,30.61 R30.P$2
N$36
  Top 0.2: J15.2 8.58,36.78 LED5.2 8.58,31.65 U24.3
N$37
  Top 0.2: R33.P$1 9.51,34.6 LED5.1
N$41
  Top 0.2: U26.1 4.4,30.61 R34.P$2
N$42
  Top 0.2: J18.2 2.98,36.78 LED7.2 2.98,31.65 U26.3
N$43
  Top 0.2: R35.P$1 3.91,34.6 LED7.1
N$44
  Top 0.2: U27.1 32.75,50.18 31.43,51.5 R36.P$2
N$49
  Top 0.2: LED9.1 32.24,46.76 R37.P$1
N$50
  Top 0.2: U30.1 32.75,40.78 31.43,42.1 R45.P$2
N$51
  Top 0.2: LED10.1 32.24,37.36 R46.P$1
N$52
  Top 0.2: U31.1 32.55,30.98 31.23,32.3 R48.P$2
N$57
  Top 0.2: LED13.1 32.04,27.56 R49.P$1
N$58
  Top 0.2: U34.1 32.55,21.58 31.23,22.9 R57.P$2
N$59
  Top 0.2: LED14.1 32.04,18.16 R58.P$1
N$60  (via drill 0.2)
  other vias: 14.7,15.7
N$61  (via drill 0.2)
  other vias: 26.2,34.3
N$62  (via drill 0.2)
  other vias: 27.5,33.4
RELAY_1_A1
  Top 0.15: R22.P$1 8.8,43.35 11.78,40.37 11.78,16.8 13.33,15.25 U5.24
RELAY_2_A1  (via drill 0.2)
  Top 0.15: v11.65,41.9 13.5,40.05 13.5,17.2 13.92,16.78 U5.21 | v3.19,41.9 R26.P$1
  Route3 0.15: v11.65,41.9 v3.19,41.9
RELAY_3_A1  (via drill 0.2)
  Top 0.15: v8.8,28.49 R30.P$1 | v12.64,28.42 12.64,17.11 13.48,16.27 U5.22
  Route3 0.15: v12.64,28.42 8.8,28.42 v8.8,28.49
RELAY_4_A1  (via drill 0.2)
  Top 0.15: U5.31 16.19,11.66 v13.96,11.66 | v1.7,29.4 3.1,29.4 R34.P$1
  Route3 0.15: v13.96,11.66 13.92,11.7 13.92,11.71 1.7,23.93 v1.7,29.4
RESET_A1
  Top 0.15: C28.P$1 9.8,17.7 12.75,14.75 U5.25 | J28.2 R62.P$1
  Top 0.254: R62.P$1 C28.P$1
SCLK
  Top 0.15: U5.46 24.79,7.09 24.18,6.48 J29.6
  Top 0.508: J29.6 J29.5
SSL0_A1
  Top 0.15: U5.45 24.29,7.99 21.64,5.34 J29.4
  Top 0.508: J29.4 J29.3
STEP_M0A1  (via drill 0.2)
  Top 0.15: U5.16 18.19,19.34 v18.15,19.3
  Top 0.152: v14.25,41.2 R7.P$1
  Route3 0.15: v18.15,19.3 13.8,23.65 13.8,40.75 v14.25,41.2
STEP_M1A1  (via drill 0.2)
  Top 0.15: U5.12 20.22,22.07 v20.25,22.1 | v21.54,42.14 22.34,42.14 R16.P$1
  Route3 0.15: v20.25,22.1 20.25,24.6 21.35,25.7 21.35,41.95 v21.54,42.14
TCK_A1
  Top 0.15: U5.32 10.81,11.19 10.15,11.85 J28.6
TDI_A1
  Top 0.15: J28.3 6.39,10.41 10.3,6.5 17.65,6.5 19.21,8.06 U5.35
TDO_A1
  Top 0.15: U5.34 18.7,8.25 17.72,7.27 11.28,7.27 7.66,10.89 J28.4
TMS_A1
  Top 0.15: U5.33 18.25,9.17 18.25,8.5 17.85,8.1 11.8,8.1 8.9,11 J28.5
VCL0_A1
  Top 0.15: U5.5 23.78,22.33 C22.P$2
VDD  (via drill 0.2)  (1 unrouted)
  Top 0.15: U5.38 20.75,9.21 C15.P$1 | C26.P$1 14.56,12.71 U5.29 | U5.20 14.56,17.29 C19.P$1 | U5.51 29.94,12.21 C20.P$1 30.25,12.5 v30.55,13.1 | U5.56 29,14.75 C24.P$1 29.23,14.52 29.23,15.42 | U5.57 29.06,15.25 29.23,15.42 | 29.23,15.42 C25.P$1 29.28,15.5 29.28,16.47 C27.P$1 28.97,16.78 U5.60 | U5.11 20.73,22.62 19.98,23.37 C23.P$2 | v17.9,12.7 16.25,12.7 | v30.4,7.9 30.4,8.65 R61.P$1
  Top 0.254: U31.3 35.83,29.97 v36,29.8 | U34.3 34.97,20.57 v36,21.6 | U18.3 27.65,39.93 v27.62,39.9 | U13.3 19.55,40.15 v19.9,39.8 | U5.38 v20.73,10.5 v20.72,10.51 | v20.73,18.57 U5.11 | U5.20 17.59,17.29 v17.6,17.3 | v4.14,19.89 v4.15,19.88 C21.P$1 R62.P$2 | R60.P$1 35.35,16.35 v36,17 | U30.3 35.27,39.77 v36,40.5 | U27.3 35.47,49.17 v36,49.7
  Top 0.305: C24.P$1 30.55,13.2 v30.55,13.1
  Top 0.508: C24.P$1 29.28,14.47 29.28,15.5 | C25.P$1 29.25,15.5 C27.P$1
  Bottom 0.254: v27.62,39.9 27.43,40.09 27.43,40.1 27.1,40.43 27.1,56.8 | v19.9,39.8 19.9,56.8
  Bottom 0.305: v17.9,12.7 18.04,12.7 18.05,12.69 19.78,12.69 20,12.91 | v20.72,10.51 20.72,12.17 20.73,12.18 | v20.73,18.57 20.73,18.03 20,17.3
  Bottom 0.508: 20,17.3 v17.6,17.3 v17.59,17.29 6.74,17.29 v4.14,19.89 | v30.4,7.9 30.55,8.05 v30.55,13.1
  Bottom 1.016: 27.1,56.8 19.9,56.8 3.1,56.8 | 20,17.3 20,12.91 20.73,12.18 29.63,12.18 v30.55,13.1 35.2,13.1 36,13.9 v36,17 v36,21.6 v36,29.8 v36,40.5 v36,49.7 36,56.8 27.1,56.8 | J1.P$2 26.79,57.11 27.1,56.8
VDD5  (via drill 0.2 layers 1-3)
  Top 0.2: 9.1,53.1 9.65,53.1 10.71,52.04 R25.P$2 | J14.1 4.05,53.1 5.11,51.84 R29.P$2 | 9.1,38.4 9.65,38.4 10.71,37.34 R33.P$2 | J18.1 4.05,38.4 5.11,37.34 R35.P$2
  Top 0.254: J15.1 9.1,38.4 | J12.1 9.1,53.1
  Top 0.813: J18.1 6.6,38.4 | 6.6,38.4 J15.1 | J14.1 6.6,53.1 | J12.1 6.6,53.1 | 6.6,38.4 6.6,53.1 | 6.6,53.1 v6.6,55.37
  Route3 0.813: 23,55.37 v6.6,55.37 2.4,55.37 | 23,55.37 36.87,55.37 | J1.P$3 22.98,55.39 23,55.37
XCIN_A1
  Top 0.152: U5.6 23.27,25.85 C2.P$1 24.11,27.18 X1.P$1
XCOUT_A1
  Top 0.152: U5.7 22.76,26.63 C12.P$1 22.7,28.27 X1.P$2
XTAL1_A1
  Top 0.15: Y2.3 20.35,27.7 C13.P$1
  Top 0.152: U5.9 21.75,23.6 20.35,25 C13.P$1
XTAL2_A1
  Top 0.15: 21.24,22.98 21.24,23.01 19.17,25.08 C14.P$1 19.17,29.11 18.73,29.55 Y2.1
  Top 0.152: U5.10 21.24,22.98

### Text on the board
tPlace: Relay 2 | Relay 1 | A1M0 | A1M1 | Limit Sw 1 | Relay 4 | Relay 3 | Limit Sw 2 | 12.0 MHz | 32.768KHz | Limit Sw 3 | DAC 1 | Limit Sw 4 | JTAG | Th 1 | Reset | TDI | TDO | TMS | TCK | Th 2